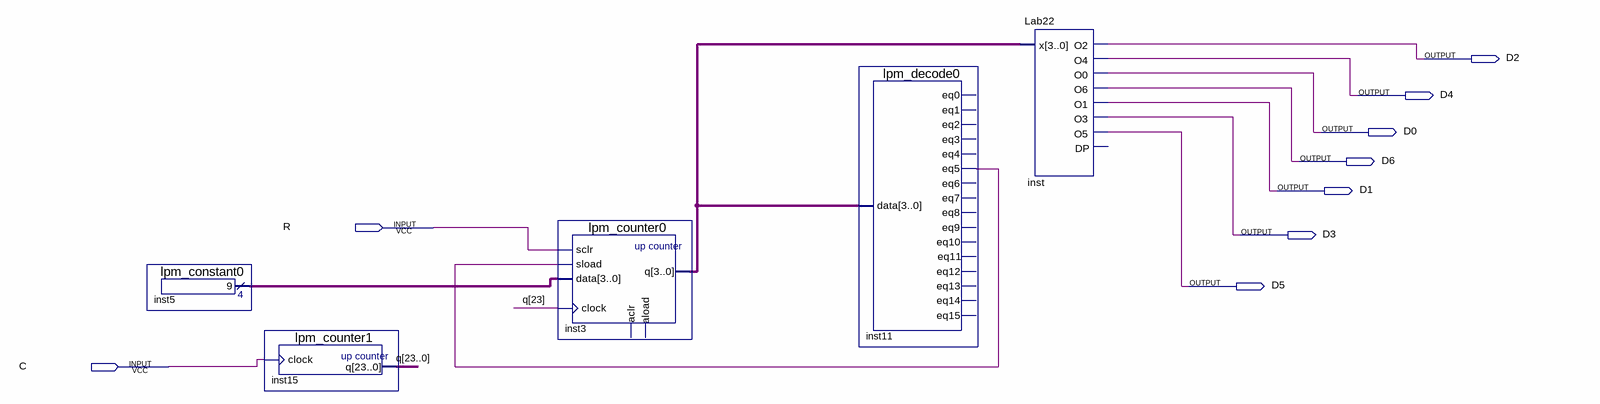
[diagram p0: schematic sheet]
// Quartus schematic Lab6.bdf as structural Verilog: 5 symbols, 9 pins
module Lab6 (
  input  R,
  input  C,
  output D2,
  output D4,
  output D0,
  output D6,
  output D1,
  output D3,
  output D5
);

  wire inst11_eq5;
  wire [3:0] inst3_q, inst5_result;
  wire [23:0] q;

  lpm_constant0 inst5 (.result(inst5_result));
  lpm_counter1 inst15 (.clock(C), .q(q));
  lpm_counter0 inst3 (
    .sclr(R), .sload(inst11_eq5), .data(inst5_result), .clock(q[23]), .q(inst3_q));  // open: aclr, aload
  lpm_decode0 inst11 (
    .data(inst3_q), .eq5(inst11_eq5));  // open: eq0, eq1, eq2, eq3, eq4, eq6, eq7, eq8, eq9, eq10, eq11, eq12, eq13, eq14, eq15
  Lab22 inst (.x(inst3_q), .O2(D2), .O4(D4), .O0(D0), .O6(D6), .O1(D1), .O3(D3), .O5(D5));  // open: DP
endmodule
